# EAGLE schematic breakout-wson6-sot23-5 (EAGLE 8.2.2)
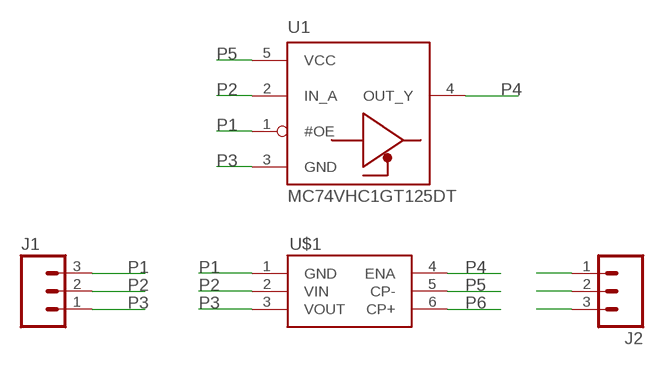
[diagram p0: schematic, sheet 1]

## Parts
J1  M03LOCK  [1X03_LOCK]
J2  M03LOCK  [1X03_LOCK]
U1  MC74VHC1GT125DT  [SOT23-5]
U$1  TPS60150  [WSON6]

## Nets
P1: J1.3 U1.1(#OE) U$1.1(GND)
P2: J1.2 U1.2(IN_A) U$1.2(VIN)
P3: J1.1 U1.3(GND) U$1.3(VOUT)
P4: J2.3 U1.4(OUT_Y) U$1.4(ENA)
P5: J2.2 U1.5(VCC) U$1.5(CP-)
P6: J2.1 U$1.6(CP+)

## Library data of the parts
J1 J2 = SparkFun-Connectors:M03: Header 3 Standard 3-pin 0.1" header. Use with straight break away headers (SKU : PRT-00116), right angle break away headers (PRT-00553), swiss pins (PRT-00743), machine pins (PRT-00117), and female headers (PRT-00115). Molex polarized connector foot print use with SKU : PRT-08232 with associated crimp pins and housings.
U1 = uri:MC74VHC1GT125: OnSemi's MC74VHC1GT125 Noninverting Buffer / CMOS Logic Level Shifter with LSTTL-Compatible Inputs Description: The MC74VHC1GT125 is a single gate noninverting buffer fabricated with silicon gate CMOS technology. It achieves high speed operation similar to equivalent Bipolar Schottky TTL while maintaining CMOS low power dissipation. The MC74VHC1GT125 requires the 3-state control input (OE) to be set High to place the output into the high impedance state. The device input is compatible with TTL-type input thresholds and the output has a full 5 V CMOS level output swing. The input protection circuitry on this device allows overvoltage tolerance on the input, allowing the device to be used as a logic-level translator from 3.0 V CMOS logic to 5.0 V CMOS Logic or from 1.8 V CMOS logic to 3.0 V CMOS Logic while operating at the high-voltage power supply. The MC74VHC1GT125 input structure provides protection when voltages up to 7 V are applied, regardless of the supply voltage. This allows the MC74VHC1GT125 to be used to interface 5 V circuits to 3 V circuits. The output structures also provide protection when VCC = 0 V. These input and output structures help prevent device destruction caused by supply voltage - input/output voltage mismatch, battery backup, hot insertion, etc. Features: High Speed: tPD = 3.5 ns (Typ) at VCC = 5 V Low Power Dissipation: ICC = 1 A (Max) at TA = 25°C TTL-Compatible Inputs: VIL = 0.8 V; VIH = 2.0 V CMOS-Compatible Outputs: VOH > 0.8 VCC; VOL < 0.1 VCC @Load Power Down Protection Provided on Inputs and Outputs Balanced Propagation Delays Pin and Function Compatible with Other Standard Logic Families Chip Complexity: FETs = 62; Equivalent Gates = 16 Please send any comments to: messi@users.sourceforge.net
U$1 = uri:TPS60150: TPS60150 - 5-V, 140-mA Charge-Pump Datasheet <http://www.ti.com/lit/ds/symlink/tps60150.pdf>